# EasyEDA schematic SCH.ODO_2025-04-28 (1).json
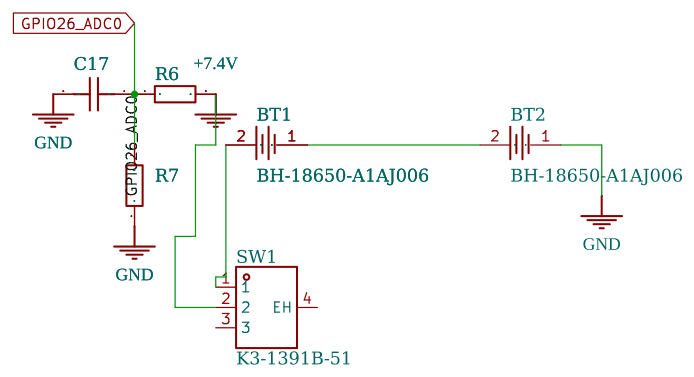
[diagram p0: schematic sheet]

## Parts
BT1  BH-18650-A1AJ006  [BAT-TH_BH-18650-A1AJ006]
BT2  BH-18650-A1AJ006  [BAT-TH_BH-18650-A1AJ006]
C17  100nF  [C0603]
R6  18K  [R0603]
R7  10K  [R0603]
SW1  K3-1391B-51  [SW-TH_K3-1391B-51]

## Library data of the parts
BT1 BT2 = -: LCSC Part Name: 电池盒; Supplier Part: C5290175; Manufacturer: MYOUNG(美阳); JLCPCB Part Class: Extended Part; Datasheet: https://atta.szlcsc.com/upload/public/pdf/source/20221129/6A895ABB0802E35760FE4A36BAA105B3.pdf; Supplier: LCSC; Add into BOM: yes; Convert to PCB: yes; Connector Type: Battery box; Contact Plating: Nickel; Operating Temperature Range: -10℃+100℃
C17 = -: Symbol: CAP; Device: CAP_0603; Convert to PCB: yes; Add into BOM: yes; Supplier Footprint: 0603
R6 R7 = -: Symbol: Res; Device: Res_0603; Convert to PCB: yes; Add into BOM: yes; Supplier Footprint: 0603
SW1 = -: LCSC Part Name: 卧插双档 滑动开关; Supplier Part: C92656; Manufacturer: 韩国韩荣; Supplier Footprint: 插件; JLCPCB Part Class: Extended Part; Datasheet: https://atta.szlcsc.com/upload/public/pdf/source/20200417/C92656_C9D6734602329AAA248C31EF7FB16FDE.pdf; Supplier: LCSC; Add into BOM: yes; Convert to PCB: yes; Circuit: Single Pole Double Throw (SPDT); Actuator Style: Rectangular column; Pin Style: PCPin; Switch Length: 13.3mm; Switch Width: 6mm; Switch Height: 6.6mm; Actuator Color: Black; Current Rating (AC): 5A; Voltage Rating (AC): 120V; Mechanical Life: 30,000 Times; Operating Temperature: -25℃+80℃

## Nets
+7.4V: R6.2 SW1.2
GND: BT2.1 C17.2 R7.1
GPIO26_ADC0: C17.1 R6.1 R7.2
Net-(BT1-1): BT1.1 BT2.2
Net-(BT1-2): BT1.2 SW1.1

Not connected (* = marked no-connect by the designer): SW1 3 4(EH)

## Notes on the sheet
- 1
- 2
- 3
- 4
- 5
- 6
- A
- A
- B
- B
- C
- C
- Schematic1
- Create at
- 2025-04-27
- Schematic
- Update at
- 2025-04-28
- Board1
- Board
- Page
- P9
- Drawn
- ODO
- D
- Reviewed
- D
- Version
- Size
- Page  2  Total  2
- V1.0
- A4
- EasyEDA.com
- 1
- 2
- 3
- 4
- 5
- 6
